# EAGLE design ll4-sensors (EAGLE 5.10)
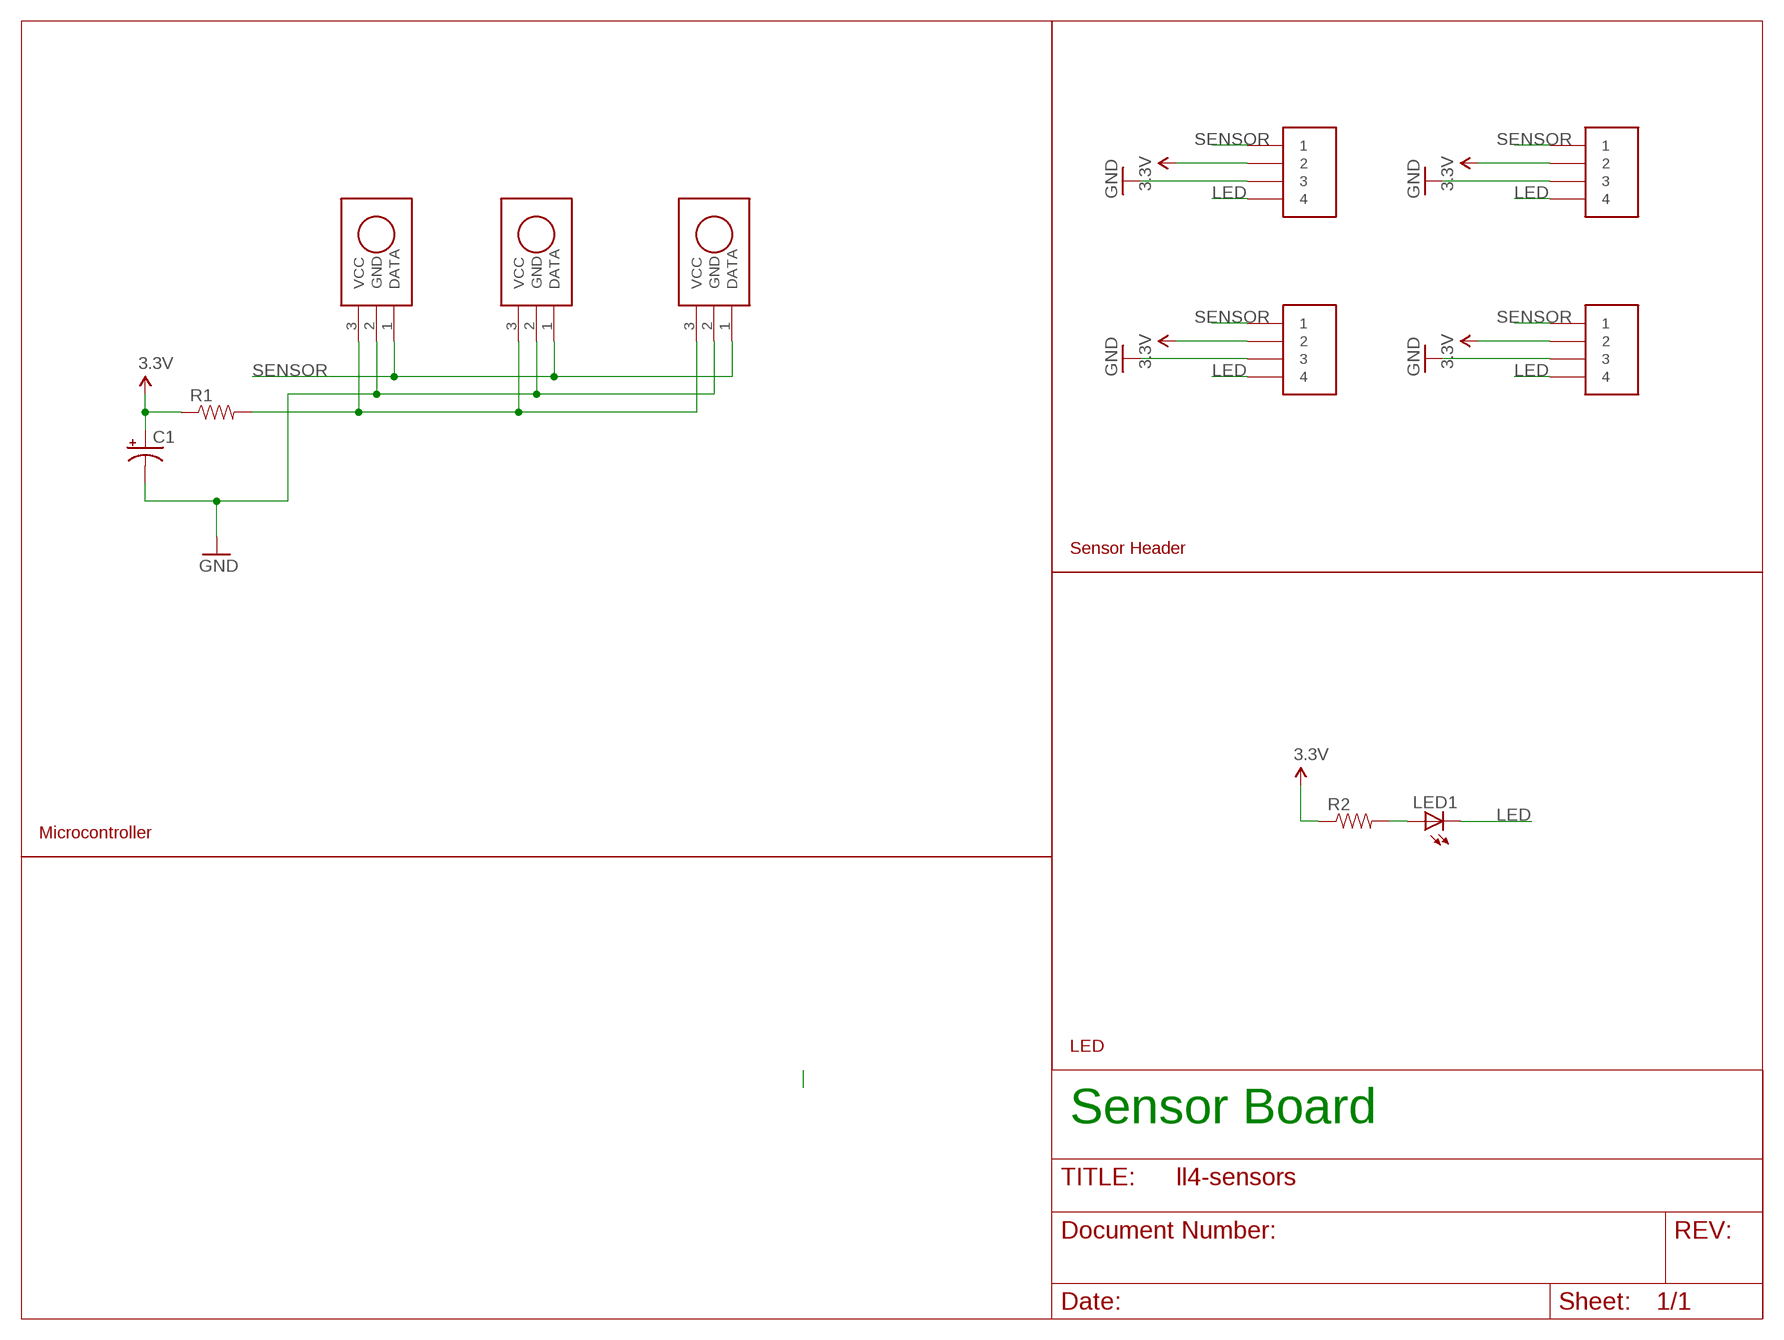
[diagram p0: schematic, sheet 1]

## Parts
C1  CAP_POLPTH2  [CPOL-RADIAL-10UF-25V]
LED1  LED5MM  [LED5MM]
R1  RESISTORPTH-1/4W  [AXIAL-0.4]
R2  RESISTORPTH-1/4W  [AXIAL-0.4]
SENSOR  4HEAD  [4HEAD]
SENSOR1  4HEAD  [4HEAD]
SENSOR2  4HEAD  [4HEAD]
SENSOR3  4HEAD  [4HEAD]
U$2  TSOP48XX  [TSOP48XX]
U$3  TSOP48XX  [TSOP48XX]
U$4  TSOP48XX  [TSOP48XX]

## Nets
3.3V: C1.1(+) R1.P$1 R2.P$1 SENSOR1.2 SENSOR2.2 SENSOR3.2 SENSOR.2
GND: C1.2(-) SENSOR1.3 SENSOR2.3 SENSOR3.3 SENSOR.3 U$2.2(GND) U$3.2(GND) U$4.2(GND)
LED: LED1.K(C) SENSOR1.4 SENSOR2.4 SENSOR3.4 SENSOR.4
N$1: LED1.A R2.P$2
N$3: R1.P$2 U$2.3(VCC) U$3.3(VCC) U$4.3(VCC)
SENSOR: SENSOR1.1 SENSOR2.1 SENSOR3.1 SENSOR.1 U$2.1(DATA) U$3.1(DATA) U$4.1(DATA)

## Notes on the sheet
- Sensor Header
- Microcontroller
- LED
- Sensor Board

## Library data of the parts
C1 = sparkfun:CAP_POL: Capacitor Polarized These are standard SMD and PTH capacitors. Normally 10uF, 47uF, and 100uF in electrolytic and tantalum varieties. Always verify the external diameter of the through hole cap, it varies with capacity, voltage, and manufacturer. The EIA devices should be standard.
LED1 = sparkfun:LED: LEDs Standard schematic elements and footprints for 5mm, 3mm, 1206, and 0603 sized LEDs. 5mm - Spark Fun Electronics SKU : COM-00529 (and others)
R1 R2 = sparkfun:RESISTOR: Resistor Basic schematic elements and footprints for 0603, 1206, and PTH resistors.
SENSOR SENSOR1-SENSOR3 = custom:4HEAD
U$2-U$4 = custom:TSOP48XX

## Board
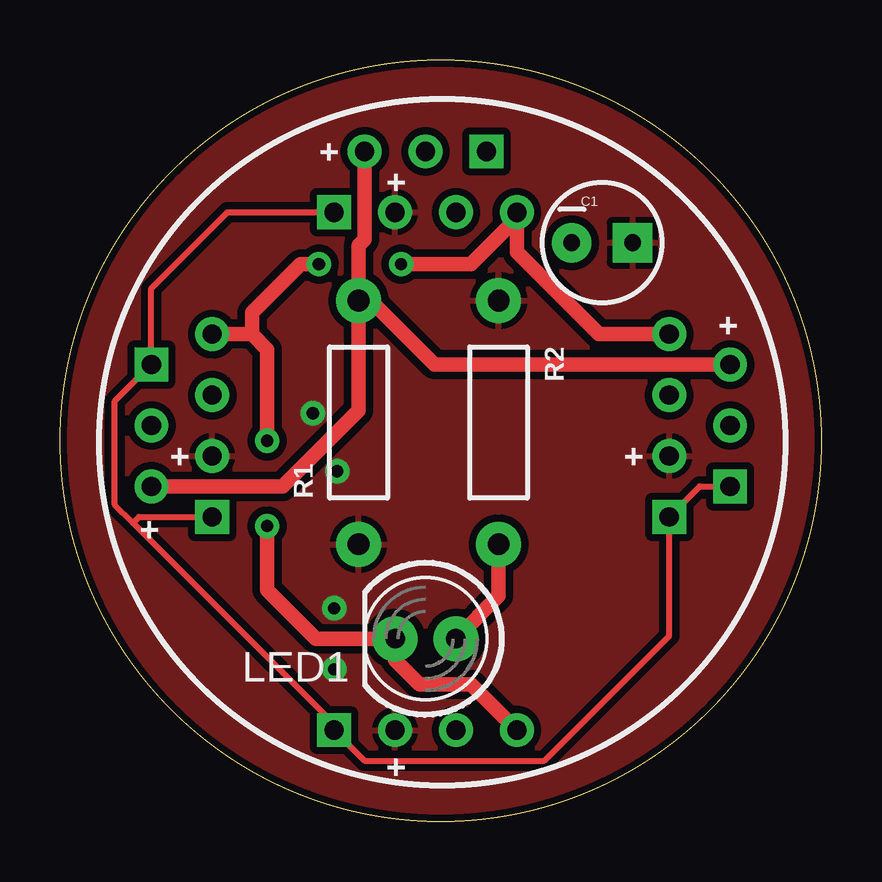
[diagram p1: board, top side]
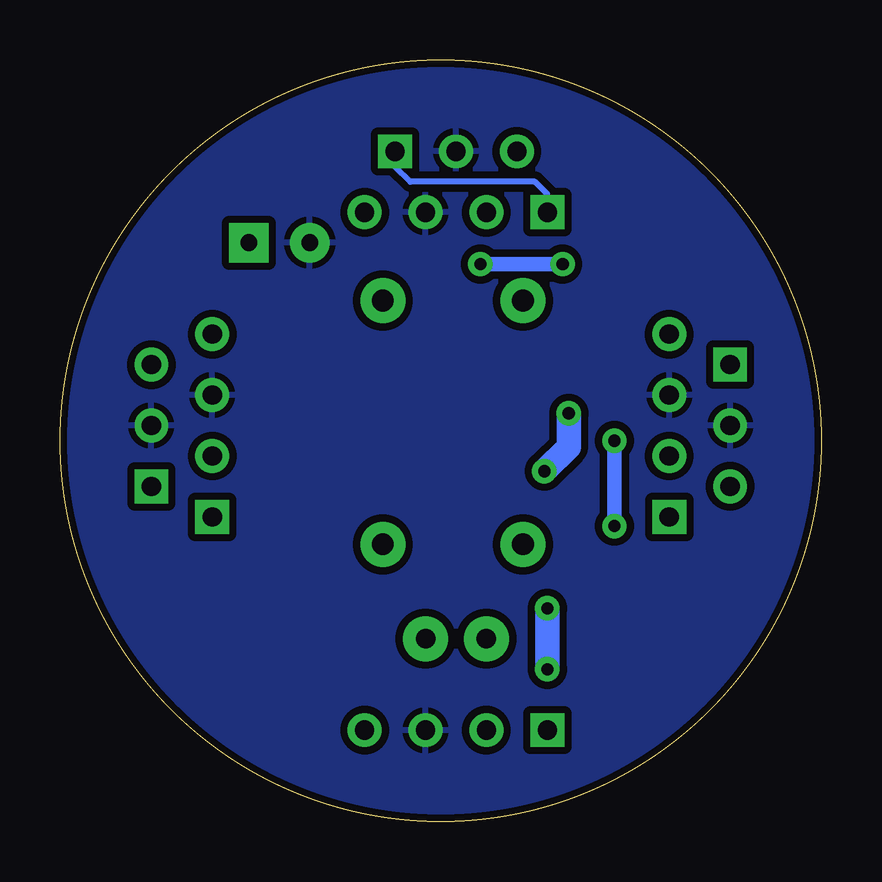
[diagram p2: board, bottom side, seen from below]

Size 31.75 x 31.75 mm. Coordinates in mm from the lower left corner, seen from the top.
Outline: circle at 15.88,15.88 radius 15.88
Copper layers (1*16): Top 0.035mm / dielectric 1.5mm / Bottom 0.035mm
Design rules "SparkFun": minimum track width 8mil, minimum drill 20mil, track to track 8mil, track to pad 8mil, pad to pad 8mil, via to via 8mil, smd to smd 8mil, copper to edge 10mil, drill to drill 8mil, minimum pad ring 12mil, minimum via ring 10mil, stop-mask expansion 4mil, vias tented up to drill 25mil, thermal gap 10mil

### Footprints (pad centres in the part's own frame; a part is rotated, then mirrored left to right if it is on the bottom)
CPOL-RADIAL-10UF-25V = drill 0.7 pad 1.651 square: 1 1.27,0 | drill 0.7 pad 1.651 round: 2 -1.27,0
LED5MM = drill 0.813 pad 1.88 round: A -1.27,0; K 1.27,0
AXIAL-0.4 = drill 0.9 pad 1.88 round: P$1 -5.08,0; P$2 5.08,0
4HEAD = drill 0.8 square: 1 -3.81,0 | drill 0.8 round: 2 -1.27,0; 3 1.27,0; 4 3.81,0
TSOP48XX = drill 0.8 square: 1 -2.54,0 | drill 0.8 round: 2 0,0; 3 2.54,0

### Placement (x,y rotation side)
C1  22.61,24.13 0 top
LED1  15.24,7.62 180 top
R1  12.45,16.64 90 top
R2  18.29,16.64 270 top
SENSOR  6.35,16.51 90 top
SENSOR1  25.4,16.51 90 top
SENSOR2  15.24,25.4 0 top
SENSOR3  15.24,3.81 0 top
U$2  27.94,16.51 90 top
U$3  3.81,16.51 270 top
U$4  15.24,27.94 180 top

### Tracks (layer width: path | path; a pad name or v marks a point on that pad's centre or on a via)
3.3V  (via drill 0.51)
  Bottom 1.016: v10.54,17.02 10.54,15.62 v11.56,14.61 | v11.43,6.35 v11.43,8.89
  pour Top (isolate 0.305): 0,31.75 31.75,31.75 31.75,0 0,0
GND
  pour Bottom (isolate 0.305): 0,31.75 31.75,31.75 31.75,0 0,0
LED  (via drill 0.51)
  Top 0.61: SENSOR3.4 17.14,5.71 14.99,5.71 13.97,6.73 LED1.K 10.67,7.62 8.64,9.65 v8.64,12.32 | 7.87,20.32 8,20.32 8.64,19.68 v8.64,15.88 | 7.87,20.32 SENSOR.4 | SENSOR1.4 22.48,20.32 19.05,23.75 SENSOR2.4 19.05,25.15 17.14,23.24 v14.22,23.24 | v10.79,23.24 10.03,23.24 8,21.21 8,20.45 7.87,20.32
  Bottom 0.61: v8.64,12.32 v8.64,15.88 | v10.79,23.24 v14.22,23.24
N$1
  Top 0.61: R2.P$2 18.29,9.4 LED1.A
N$3
  Top 0.61: 12.45,22.23 R1.P$2 12.45,17.14 9.27,13.97 U$3.3 | 12.45,22.23 12.45,24 12.7,24.26 U$4.3 | U$2.3 15.62,19.05 12.45,22.23
SENSOR
  Top 0.254: U$2.1 26.67,13.97 SENSOR1.1 25.4,7.75 20.19,2.54 12.7,2.54 SENSOR3.1 11.43,4.06 3.05,12.45 | 3.05,12.45 2.29,13.21 2.29,17.53 U$3.1 3.81,22.23 6.99,25.4 SENSOR2.1 | SENSOR.1 3.3,12.7 3.05,12.45
  Bottom 0.254: SENSOR2.1 11.43,26.16 11.94,26.67 17.14,26.67 17.78,27.3 U$4.1

### Text on the board
tPlace: + | + | + | + | + | + | +